# Altium schematic sheet PMIC.SchDoc
size 420 x 297 mm; SheetNumber: 11; SheetTotal: 21
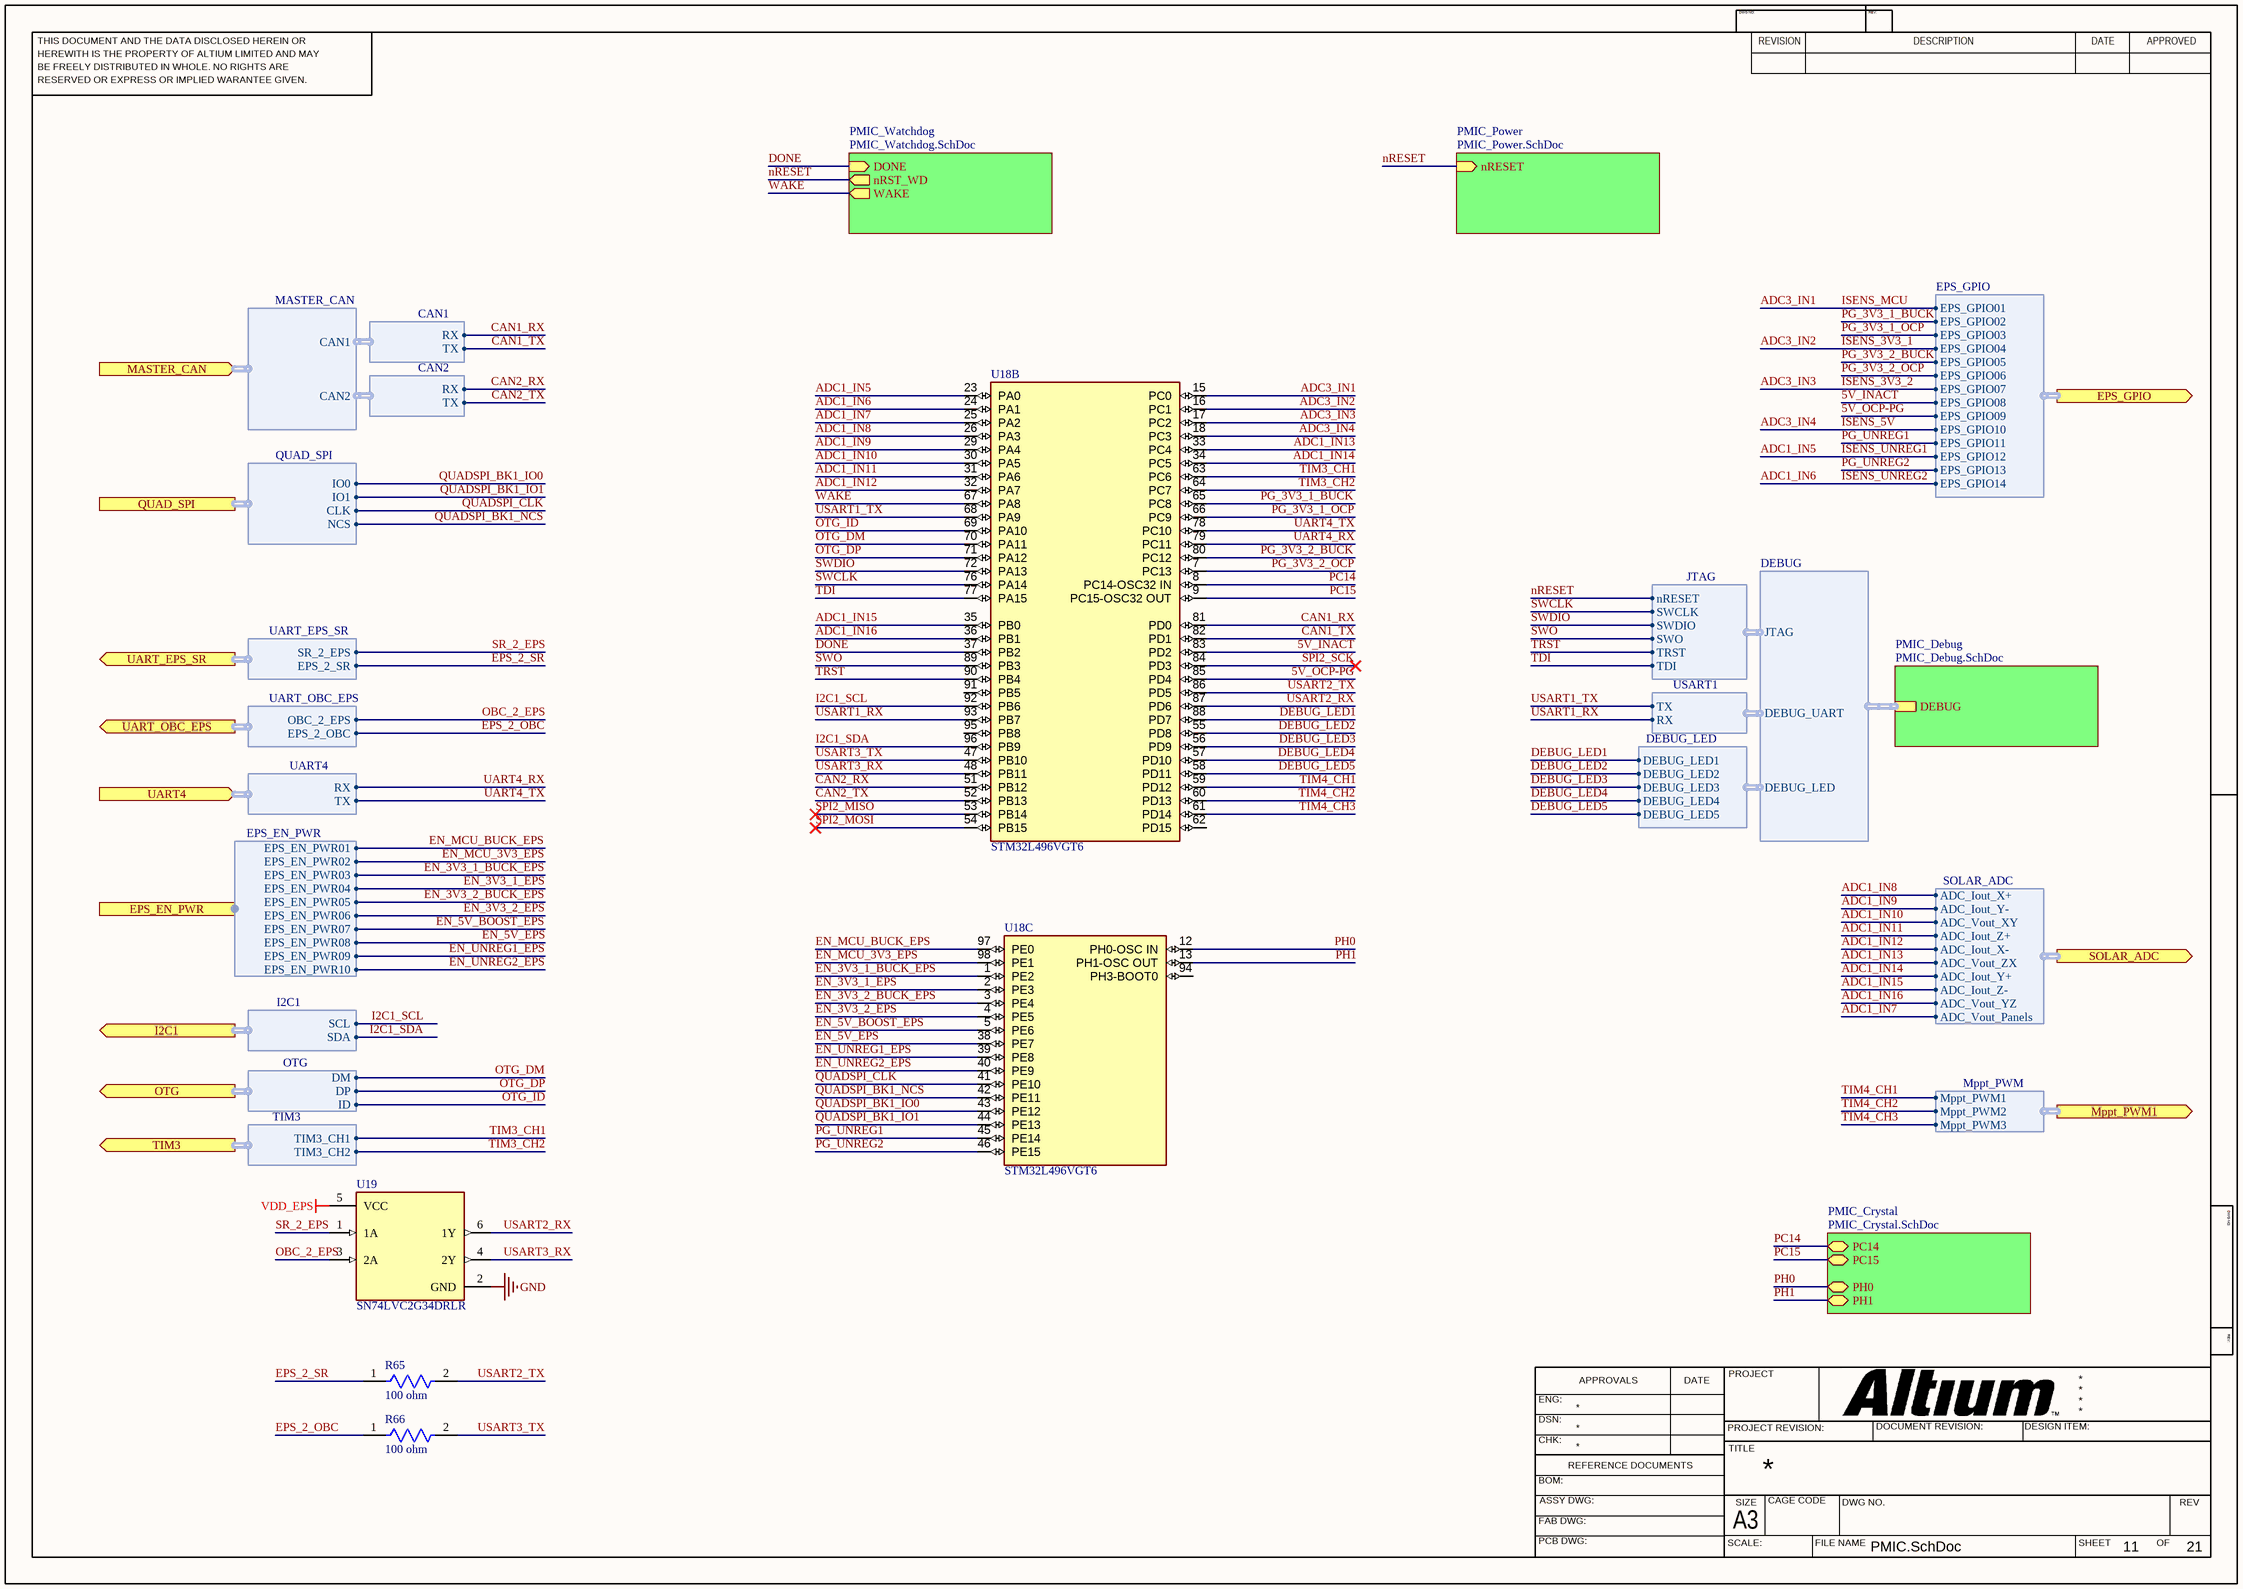
[diagram p0: PMIC.SchDoc]

## Parts
R65  100 ohm  [FP-ERJP03-MFG]
R66  100 ohm  [FP-ERJP03-MFG]
U18  STM32L496VGT6  [FP-LQFP100-1L-MFG]  (parts B,C of 3)
U19  SN74LVC2G34DRLR  [FP-DRL0006A-MFG]

## Sub-sheets
PMIC_Crystal = PMIC_Crystal.SchDoc: PC14 (bidir), PC15 (bidir), PH0 (bidir), PH1 (bidir)
PMIC_Debug = PMIC_Debug.SchDoc: DEBUG (harness DEBUG)
PMIC_Power = PMIC_Power.SchDoc: nRESET (in)
PMIC_Watchdog = PMIC_Watchdog.SchDoc: nRST_WD (out), DONE (in), WAKE (out)

## Ports
EPS_EN_PWR (out, harness EPS_EN_PWR), EPS_GPIO (out, harness EPS_GPIO), I2C1 (out, harness I2C1), MASTER_CAN (in, harness MASTER_CAN), Mppt_PWM1 (out, harness Mppt_PWM), OTG (out, harness OTG), QUAD_SPI (harness QUAD_SPI), SOLAR_ADC (out, harness SOLAR_ADC), TIM3 (out, harness TIM3), UART4 (in, harness UART4), UART_EPS_SR (out, harness UART_EPS_SR), UART_OBC_EPS (out, harness UART_OBC_EPS)

## Harnesses
MASTER_CAN: CAN1, CAN2
CAN1: TX, RX
CAN2: TX, RX
QUAD_SPI: IO0, IO1, CLK, NCS
EPS_GPIO: EPS_GPIO01, EPS_GPIO02, EPS_GPIO03, EPS_GPIO04, EPS_GPIO05, EPS_GPIO06, EPS_GPIO07, EPS_GPIO08, EPS_GPIO09, EPS_GPIO10, EPS_GPIO11, EPS_GPIO12, EPS_GPIO13, EPS_GPIO14
UART4: TX, RX
UART_EPS_SR: EPS_2_SR, SR_2_EPS
UART_OBC_EPS: EPS_2_OBC, OBC_2_EPS
EPS_EN_PWR: EPS_EN_PWR01, EPS_EN_PWR02, EPS_EN_PWR03, EPS_EN_PWR04, EPS_EN_PWR05, EPS_EN_PWR06, EPS_EN_PWR07, EPS_EN_PWR08, EPS_EN_PWR09, EPS_EN_PWR10
DEBUG: JTAG, DEBUG_UART, DEBUG_LED
JTAG: nRESET, SWCLK, SWDIO, SWO, TDI, TRST
USART1: TX, RX
DEBUG_LED: DEBUG_LED1, DEBUG_LED2, DEBUG_LED3, DEBUG_LED4, DEBUG_LED5
SOLAR_ADC: ADC_Iout_X+, ADC_Iout_Y-, ADC_Vout_XY, ADC_Iout_Z+, ADC_Iout_X-, ADC_Vout_ZX, ADC_Iout_Y+, ADC_Iout_Z-, ADC_Vout_YZ, ADC_Vout_Panels
Mppt_PWM: Mppt_PWM1, Mppt_PWM2, Mppt_PWM3
I2C1: SDA, SCL
OTG: DM, DP, ID
TIM3: TIM3_CH2, TIM3_CH1

## Nets
GND: U19.2(GND)
VDD_EPS: U19.5(VCC)
5V_INACT: U18.83(PD2) ; port EPS_GPIO.EPS_GPIO08
5V_OCP-PG: U18.85(PD4) ; port EPS_GPIO.EPS_GPIO09
ADC1_IN5: U18.23(PA0) ; port EPS_GPIO.EPS_GPIO12  [also labelled ISENS_UNREG1]
ADC1_IN6: U18.24(PA1) ; port EPS_GPIO.EPS_GPIO14  [also labelled ISENS_UNREG2]
ADC1_IN7: U18.25(PA2) ; port SOLAR_ADC.ADC_Vout_Panels
ADC1_IN8: U18.26(PA3) ; port SOLAR_ADC.ADC_Iout_X+
ADC1_IN9: U18.29(PA4) ; port SOLAR_ADC.ADC_Iout_Y-
ADC1_IN10: U18.30(PA5) ; port SOLAR_ADC.ADC_Vout_XY
ADC1_IN11: U18.31(PA6) ; port SOLAR_ADC.ADC_Iout_Z+
ADC1_IN12: U18.32(PA7) ; port SOLAR_ADC.ADC_Iout_X-
ADC1_IN13: U18.33(PC4) ; port SOLAR_ADC.ADC_Vout_ZX
ADC1_IN14: U18.34(PC5) ; port SOLAR_ADC.ADC_Iout_Y+
ADC1_IN15: U18.35(PB0) ; port SOLAR_ADC.ADC_Iout_Z-
ADC1_IN16: U18.36(PB1) ; port SOLAR_ADC.ADC_Vout_YZ
ADC3_IN1: U18.15(PC0) ; port EPS_GPIO.EPS_GPIO01  [also labelled ISENS_MCU]
ADC3_IN2: U18.16(PC1) ; port EPS_GPIO.EPS_GPIO04  [also labelled ISENS_3V3_1]
ADC3_IN3: U18.17(PC2) ; port EPS_GPIO.EPS_GPIO07  [also labelled ISENS_3V3_2]
ADC3_IN4: U18.18(PC3) ; port EPS_GPIO.EPS_GPIO10  [also labelled ISENS_5V]
CAN1_RX: U18.81(PD0) ; harness CAN1.RX
CAN1_TX: U18.82(PD1) ; harness CAN1.TX
CAN2_RX: U18.51(PB12) ; harness CAN2.RX
CAN2_TX: U18.52(PB13) ; harness CAN2.TX
DEBUG_LED1: U18.88(PD7) ; harness DEBUG_LED.DEBUG_LED1
DEBUG_LED2: U18.55(PD8) ; harness DEBUG_LED.DEBUG_LED2
DEBUG_LED3: U18.56(PD9) ; harness DEBUG_LED.DEBUG_LED3
DEBUG_LED4: U18.57(PD10) ; harness DEBUG_LED.DEBUG_LED4
DEBUG_LED5: U18.58(PD11) ; harness DEBUG_LED.DEBUG_LED5
DONE: U18.37(PB2) ; sheet PMIC_Watchdog/DONE
EN_3V3_1_BUCK_EPS: U18.1(PE2) ; port EPS_EN_PWR.EPS_EN_PWR03
EN_3V3_1_EPS: U18.2(PE3) ; port EPS_EN_PWR.EPS_EN_PWR04
EN_3V3_2_BUCK_EPS: U18.3(PE4) ; port EPS_EN_PWR.EPS_EN_PWR05
EN_3V3_2_EPS: U18.4(PE5) ; port EPS_EN_PWR.EPS_EN_PWR06
EN_5V_BOOST_EPS: U18.5(PE6) ; port EPS_EN_PWR.EPS_EN_PWR07
EN_5V_EPS: U18.38(PE7) ; port EPS_EN_PWR.EPS_EN_PWR08
EN_MCU_3V3_EPS: U18.98(PE1) ; port EPS_EN_PWR.EPS_EN_PWR02
EN_MCU_BUCK_EPS: U18.97(PE0) ; port EPS_EN_PWR.EPS_EN_PWR01
EN_UNREG1_EPS: U18.39(PE8) ; port EPS_EN_PWR.EPS_EN_PWR09
EN_UNREG2_EPS: U18.40(PE9) ; port EPS_EN_PWR.EPS_EN_PWR10
EPS_2_OBC: R66.1 ; port UART_OBC_EPS.EPS_2_OBC
EPS_2_SR: R65.1 ; port UART_EPS_SR.EPS_2_SR
I2C1_SCL: U18.92(PB6) ; port I2C1.SCL
I2C1_SDA: U18.96(PB9) ; port I2C1.SDA
nRESET: sheet PMIC_Watchdog/nRST_WD, sheet PMIC_Power/nRESET, harness JTAG.nRESET
OBC_2_EPS: U19.3(2A) ; port UART_OBC_EPS.OBC_2_EPS
OTG_DM: U18.70(PA11) ; port OTG.DM
OTG_DP: U18.71(PA12) ; port OTG.DP
OTG_ID: U18.69(PA10) ; port OTG.ID
PC14: U18.8(PC14-OSC32_IN) ; sheet PMIC_Crystal/PC14
PC15: U18.9(PC15-OSC32_OUT) ; sheet PMIC_Crystal/PC15
PG_3V3_1_BUCK: U18.65(PC8) ; port EPS_GPIO.EPS_GPIO02
PG_3V3_1_OCP: U18.66(PC9) ; port EPS_GPIO.EPS_GPIO03
PG_3V3_2_BUCK: U18.80(PC12) ; port EPS_GPIO.EPS_GPIO05
PG_3V3_2_OCP: U18.7(PC13) ; port EPS_GPIO.EPS_GPIO06
PG_UNREG1: U18.45(PE14) ; port EPS_GPIO.EPS_GPIO11
PG_UNREG2: U18.46(PE15) ; port EPS_GPIO.EPS_GPIO13
PH0: U18.12(PH0-OSC_IN) ; sheet PMIC_Crystal/PH0
PH1: U18.13(PH1-OSC_OUT) ; sheet PMIC_Crystal/PH1
QUADSPI_BK1_IO0: U18.43(PE12) ; port QUAD_SPI.IO0
QUADSPI_BK1_IO1: U18.44(PE13) ; port QUAD_SPI.IO1
QUADSPI_BK1_NCS: U18.42(PE11) ; port QUAD_SPI.NCS
QUADSPI_CLK: U18.41(PE10) ; port QUAD_SPI.CLK
SPI2_MISO: U18.53(PB14)
SPI2_MOSI: U18.54(PB15)
SPI2_SCK: U18.84(PD3)
SR_2_EPS: U19.1(1A) ; port UART_EPS_SR.SR_2_EPS
SWCLK: U18.76(PA14) ; harness JTAG.SWCLK
SWDIO: U18.72(PA13) ; harness JTAG.SWDIO
SWO: U18.89(PB3) ; harness JTAG.SWO
TDI: U18.77(PA15) ; harness JTAG.TDI
TIM3_CH1: U18.63(PC6) ; port TIM3.TIM3_CH1
TIM3_CH2: U18.64(PC7) ; port TIM3.TIM3_CH2
TIM4_CH1: U18.59(PD12) ; port Mppt_PWM1.Mppt_PWM1
TIM4_CH2: U18.60(PD13) ; port Mppt_PWM1.Mppt_PWM2
TIM4_CH3: U18.61(PD14) ; port Mppt_PWM1.Mppt_PWM3
TRST: U18.90(PB4) ; harness JTAG.TRST
UART4_RX: U18.79(PC11) ; port UART4.RX
UART4_TX: U18.78(PC10) ; port UART4.TX
USART1_RX: U18.93(PB7) ; harness USART1.RX
USART1_TX: U18.68(PA9) ; harness USART1.TX
USART2_RX: U18.87(PD6) U19.6(1Y)
USART2_TX: R65.2 U18.86(PD5)
USART3_RX: U18.48(PB11) U19.4(2Y)
USART3_TX: R66.2 U18.47(PB10)
WAKE: U18.67(PA8) ; sheet PMIC_Watchdog/WAKE

Not connected (* = marked no-connect by the designer): U18 62(PD15) 91(PB5) 94(PH3-BOOT0) 95(PB8)

## Notes on the sheet
- THIS DOCUMENT AND THE DATA DISCLOSED HEREIN OR
- HEREWITH IS THE PROPERTY OF ALTIUM LIMITED AND MAY
- DWG NO:
- REVISION
- REV:
- DESCRIPTION
- DATE
- APPROVED
- BE FREELY DISTRIBUTED IN WHOLE. NO RIGHTS ARE
- RESERVED OR EXPRESS OR IMPLIED WARANTEE GIVEN.
- ENG:
- APPROVALS
- PROJECT
- DSN:
- CHK:
- REFERENCE DOCUMENTS
- PROJECT REVISION:
- TITLE
- DOCUMENT REVISION:
- DESIGN ITEM:
- BOM:
- FAB DWG:
- PCB DWG:
- ASSY DWG:
- SCALE:
- A3
- SIZE
- CAGE CODE
- FILE NAME
- DWG NO.
- SHEET
- OF
- REV

## Library data of the parts
R65 R66 = CMP-00287-21317759-1: ERJ-P03F1000V SMD Chip Resistor, 100 Ohm, ± 1%, 200 mW, 0603 [1608 Metric], Thick Film, Anti-Surge; Temperature Coefficient: 200ppm/°C; Resistance: 100Ω; Voltage Rating (DC): 150V; Power Rating: 200mW; Tolerance: 1%; Termination: Tab; RoHS: Compliant; Composition: Thick Film; Min Operating Temperature: -55°C; Contact Plating: Tin; Case Code (Metric): 1608; Case/Package: 0603; Radiation Hardening: No; Mount: Surface Mount; Voltage Rating: 150V; Packaging: Cut Tape; Length: 1.6mm; REACH SVHC: No SVHC; Max Operating Temperature: 155°C; Depth: 800µm; Number of Pins: 2; Lifecycle Status: Production; Schedule B: 8533210045, 8533210045; Military Standard: Not; Height: 550µm; NexarPartId: 21317759; Case Code (Imperial): 0603
U18 = CMP-12105-000032-1: IC MCU 32BIT 1MB FLASH 100LQFP; Manufacturer: STMicroelectronics; Ram Size: 320KBytes; Number Of Usb Channels: 1; Interface: I2C,SPI,UART,USART,CAN,USB,LIN,IrDA,Other; Frequency: 80MHz; Min Supply Voltage: 1.05V; Number Of I/Os: 83; Number Of Adc Channels: 16; Number Of Spi Channels: 3; Core Architecture: ARM Cortex-M4; Number Of I2C Channels: 4; Number Of Uart Channels: 6; Max Junction Temp: +105°C; Number Of Pwm Channels: 2; Data Bus Width: 32bits; Standoff Height: 0.05mm; Memory Type: FLASH,SRAM; Max Supply Voltage: 3.6V; Memory Size: 1MBytes; Temperature Range High: +85°C; Device Class L2: Embedded Processors and Controllers; Number Of Cores: 1; Temperature Range Low: -40°C; ComponentLink2URL: https://www.st.com/content/ccc/resource/technical/document/datasheet/group3/3f/73/19/d1/d4/9e/48/34/DM00284211/files/DM00284211.pdf/jcr:content/translations/en.DM00284211.pdf; Temperature: -40°C to +85°C; Device Class L3: Microcontrollers; Device Class L1: Integrated Circuits (ICs); Height: 1.6mm; Manufacturer Part Number: STM32L496VGT6; Ambient Temperature Range Low: -40°C; RoHS: TRUE; Automotive: No; Number Of A/D Converters: 3; Ambient Temperature Range High: +85°C; Digikey Description: IC MCU 32BIT 1MB FLASH 100LQFP; ComponentLink2Description: Datasheet; Package: LQFP100-1L; Lead Free: Yes; Octopart: https://octopart.com/stm32l496vgt6-stmicroelectronics-80826723; Category: IC; Number Of Timers/Counters: 16
U19 = CMP-0859-00812-4: IC BUFFER NON-INVERT 5.5V 6SOT; Number of Bits per Element: 1; Number of Bits: 2; Low Level Output Current: 32mA; Polarity: Non-Inverting; Min Supply Voltage: 1.65V; Propagation Delay: 8.6ns; High Level Output Current: -32mA; Quiescent Current: 10uA; Contact Plating: Gold; Case/Package: SOT; Technology: CMOS; Min Operating Temperature: -40°C; Number of Elements: 2; REACH SVHC: No SVHC; Number of Channels: 2; Series: 74LVC; Number of Pins: 6; Mount: Surface Mount; Logic Function: Buffer; Number of Output Lines: 2; Packaging: Tape and Reel; Package Quantity: 4000; Radiation Hardening: No; Number of Gates: 2; Turn-On Delay Time: 8.6ns; Max Operating Temperature: 125°C; Max Supply Voltage: 5.5V; Lead Free: Lead Free; RoHS Compliant: Yes; Number of Outputs: 2; Number of Inputs: 2; Number of Input Lines: 2